# Altium schematic sheet Rcrd Brkr.SchDoc
size A3
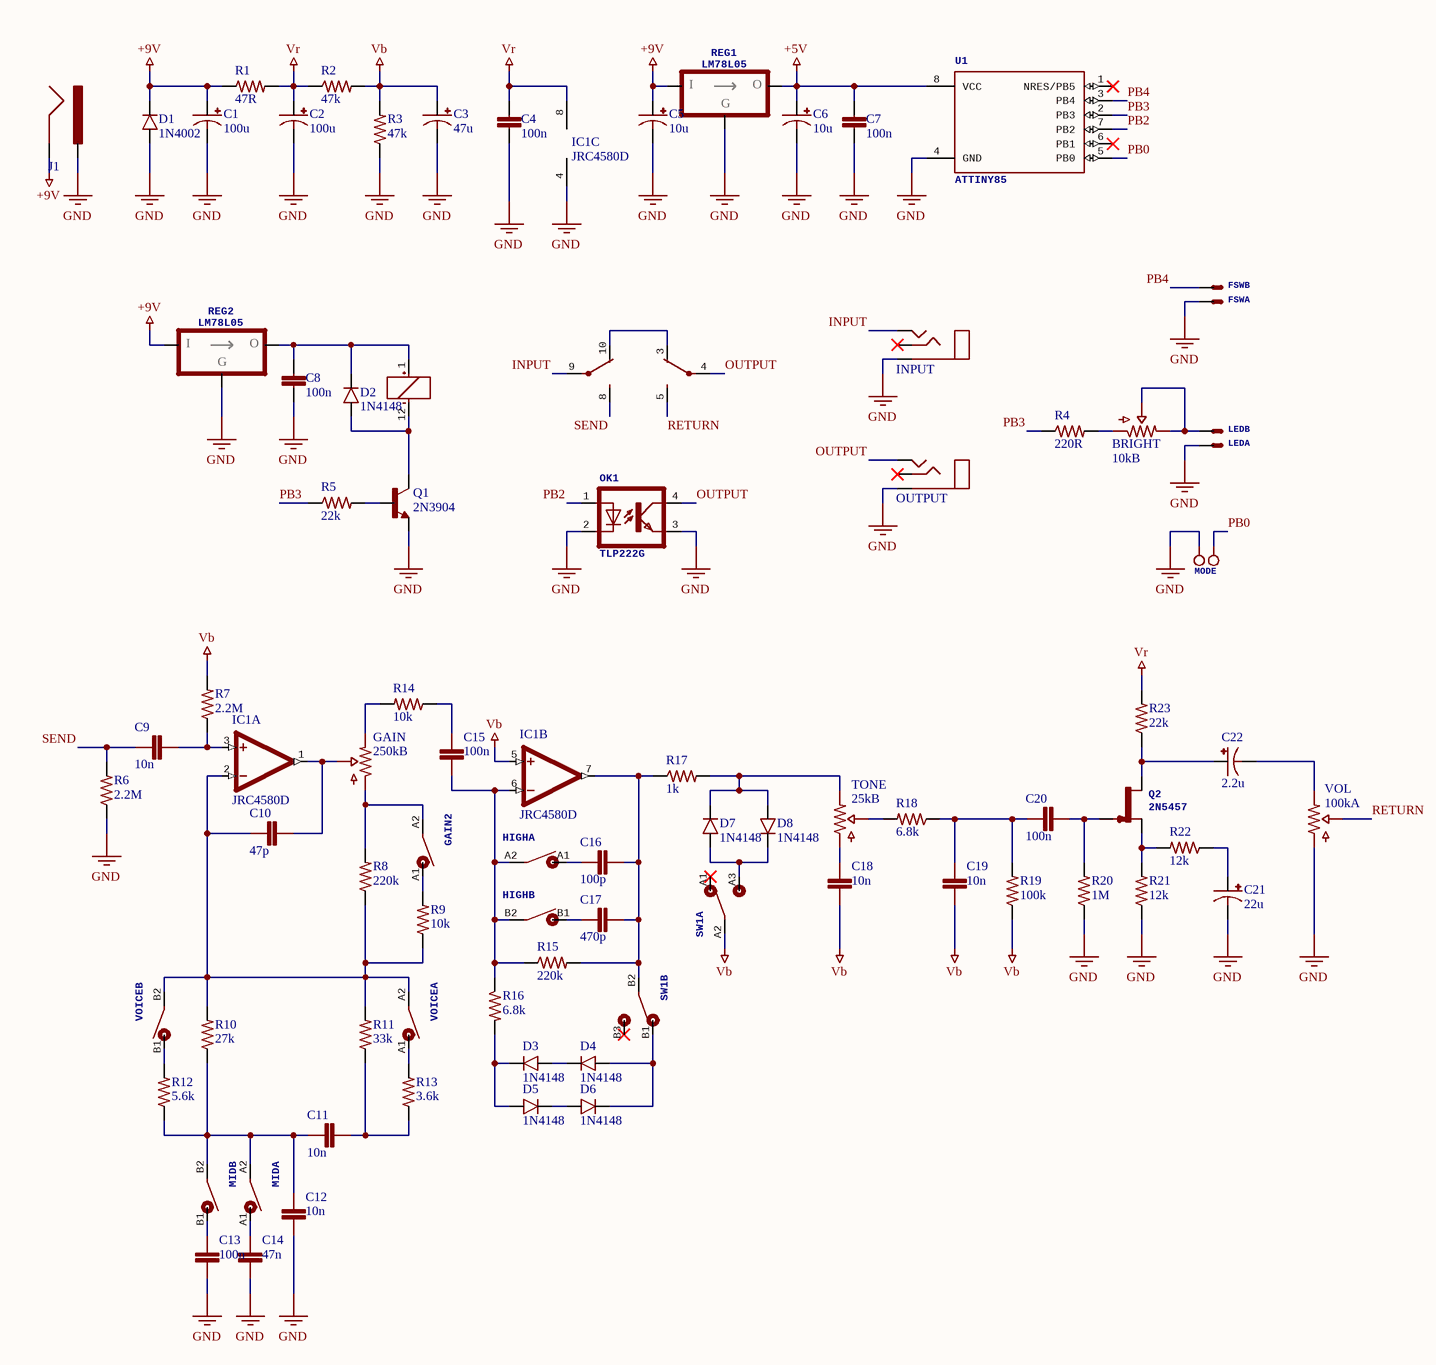
[diagram p0: Rcrd Brkr.SchDoc]

## Parts
BRIGHT  10kB  [BOURNS_3362P]
C1  100u  [ELEC_050_020]
C2  100u  [ELEC_050_020]
C3  47u  [ELEC_050_020]
C4  100n  [CER_050]
C5  10u  [ELEC_040_020]
C6  10u  [ELEC_040_020]
C7  100n  [CER_050]
C8  100n  [CER_050]
C9  10n  [FILMBOX_SMALL]
C10  47p  [CER_050]
C11  10n  [FILMBOX_SMALL]
C12  10n  [FILMBOX_SMALL]
C13  100n  [FILMBOX_SMALL]
C14  47n  [FILMBOX_SMALL]
C15  100n  [FILMBOX_SMALL]
C16  100p  [CER_050]
C17  470p  [CER_050]
C18  10n  [FILMBOX_SMALL]
C19  10n  [FILMBOX_SMALL]
C20  100n  [FILMBOX_SMALL]
C21  22u  [ELEC_LESR_050_020]
C22  2.2u  [ELEC_LESR_050_020]
D1  1N4002  [DO41_2]
D2  1N4148  [DO35_2]
D3  1N4148  [DO35_2]
D4  1N4148  [DO35_2]
D5  1N4148  [DO35_2]
D6  1N4148  [DO35_2]
D7  1N4148  [DO35_2]
D8  1N4148  [DO35_2]
FSW  (no value)  [JST-XH-02]  (parts A,B of 2)
GAIN  250kB  [ALPHA_16mm_BOTTOM]
GAIN2  DIP  [DIP_1WAY]  (value not drawn)
HIGH  DIP  [DIP_2WAY]  (value not drawn)  (parts A,B of 2)
IC1  JRC4580D  [DIL8]  (parts A,B,C of 3)
INPUT  (no value)  [STEREO]
J1  DC_JACK  [DC_JACK]  (value not drawn)
K1  (no value)  [NA5]  (parts A,B,C of 3)
LED  (no value)  [JST-XH-02]  (parts A,B of 2)
MID  DIP  [DIP_2WAY]  (value not drawn)  (parts A,B of 2)
MODE  HEADER_2PINS  [HEADER_2PINS]  (value not drawn)
OK1  TLP222G  [DIL4]
OUTPUT  (no value)  [STEREO]
Q1  2N3904  [TO92]
Q2  2N5457  [TO92]
R1  47R  [R_3_47R_025W]
R2  47k  [R_3_47k_025W]
R3  47k  [R_3_47k_025W]
R4  220R  [R_3_220R_025W]
R5  22k  [R_3_22k_025W]
R6  2.2M  [R_3_2,2M_025W]
R7  2.2M  [R_3_2,2M_025W]
R8  220k  [R_3_220k_025W]
R9  10k  [R_3_10k_025W]
R10  27k  [R_3_27k_025W]
R11  33k  [R_3_33k_025W]
R12  5.6k  [R_3_5.6k_025W]
R13  3.6k  [R_3_3.6k_025W]
R14  10k  [R_3_10k_025W]
R15  220k  [R_3_220k_025W]
R16  6.8k  [R_3_6.8k_025W]
R17  1k  [R_3_1k_025W]
R18  6.8k  [R_3_6.8k_025W]
R19  100k  [R_3_100k_025W]
R20  1M  [R_3_1M_025W]
R21  12k  [R_3_12k_025W]
R22  12k  [R_3_12k_025W]
R23  22k  [R_3_22k_025W]
REG1  LM78L05  [TO92]
REG2  LM78L05  [TO92]
SW1  DPDT  [DPDT]  (value not drawn)  (parts A,B of 2)
TONE  25kB  [ALPHA_16mm_BOTTOM]
U1  ATTINY85  [DIP8]
VOICE  DIP  [DIP_2WAY]  (value not drawn)  (parts A,B of 2)
VOL  100kA  [ALPHA_16mm_BOTTOM]

## Nets
+5V: C6.+ C7.2 REG1.3(VO) U1.8(VCC)
+9V: C1.+ C5.+ D1.C J1.GND R1.1 REG1.1(VI) REG2.1(VI)
GND: C1.- C2.- C3.- C4.2 C5.- C6.- C7.1 C8.2 C12.2 C13.2 C14.2 C21.- D1.A FSW.2(S) IC1.4(V-) INPUT.S J1.PWR LED.2(S) MODE.1 OK1.2(C) OK1.3(EMIT) OUTPUT.S Q1.3(E) R3.1 R6.1 R20.1 R21.1 REG1.2(GND) REG2.2(GND) U1.4(GND) VOL.1
Vb: C3.+ C18.2 C19.1 IC1.5(+IN) R2.2 R3.2 R7.2 R19.1 SW1.A2
Vr: C2.+ C4.1 IC1.8(V+) R1.2 R2.1 R23.2
INPUT: INPUT.T K1.9(P)
OUTPUT: K1.4(P) OK1.4(COL) OUTPUT.T
PB0: MODE.2 U1.5(PB0)
PB2: OK1.1(A) U1.7(PB2)
PB3: R4.1 R5.1 U1.2(PB3)
PB4: FSW.1(S) U1.3(PB4)
RETURN: K1.5(S) VOL.2
SEND: C9.2 K1.8(S) R6.2
NetBRIGHT_1: BRIGHT.1 R4.2
NetBRIGHT_2: BRIGHT.2 BRIGHT.3 LED.1(S)
NetC8_1: C8.1 D2.C K1.1(+) REG2.3(VO)
NetC9_1: C9.1 IC1.3(+IN) R7.1
NetC10_1: C10.1 GAIN.2 IC1.1(OUT)
NetC10_2: C10.2 IC1.2(-IN) R8.1 R9.1 R10.2 R11.2 VOICE.A2 VOICE.B2
NetC11_1: C11.1 R11.1 R13.1
NetC11_2: C11.2 C12.1 MID.A2 MID.B2 R10.1 R12.1
NetC13_1: C13.1 MID.B1
NetC14_1: C14.1 MID.A1
NetC15_1: C15.1 R14.1
NetC15_2: C15.2 HIGH.A2 HIGH.B2 IC1.6(-IN) R15.1 R16.1
NetC16_1: C16.1 C17.1 IC1.7(OUT) R15.2 R17.1 SW1.B2
NetC16_2: C16.2 HIGH.A1
NetC17_2: C17.2 HIGH.B1
NetC18_1: C18.1 TONE.1
NetC19_2: C19.2 C20.2 R18.1 R19.2
NetC20_1: C20.1 Q2.1(G) R20.2
NetC21_+: C21.+ R22.1
NetC22_+: C22.+ Q2.3(D) R23.1
NetC22_-: C22.- VOL.3
NetD2_A: D2.A K1.12(-) Q1.1(C)
NetD3_A: D3.A D4.C
NetD3_C: D3.C D5.A R16.2
NetD4_A: D4.A D6.C SW1.B1
NetD5_C: D5.C D6.A
NetD7_A: D7.A D8.C SW1.A3
NetD7_C: D7.C D8.A R17.2 TONE.3
NetGAIN2_A1: GAIN2.A1 R9.2
NetGAIN_1: GAIN.1 GAIN2.A2 R8.2
NetGAIN_3: GAIN.3 R14.2
NetK1_3: K1.3(O) K1.10(O)
NetQ1_2: Q1.2(B) R5.2
NetQ2_2: Q2.2(S) R21.2 R22.2
NetR12_2: R12.2 VOICE.B1
NetR13_2: R13.2 VOICE.A1
NetR18_2: R18.2 TONE.2

Not connected (* = marked no-connect by the designer): INPUT R*; OUTPUT R*; SW1 A1(1)* B3(3)*; U1 1(NRES/PB5)* 6(PB1)*

## Notes on the sheet
- (in symbol LM78L05) I; O; G

## Library data of the parts
BRIGHT = TRIM_10kB_3362P: 10k Lin 3362P trimmer; Price: 0.1
C1 C2 = C_ELEC_100u_16V: 100u 16V electrolytic capacitor; PinSpacing: 2mm; Price: 0.02; Dimensions: 5x8mm; Package: Radial
C3 = ELEC_47u_25V: 47u 25V electrolytic capacitor; PinSpacing: 2mm; Dimensions: 5x8mm; Package: Radial; Price: 0.02
C4 C7 C8 = CER_100n: 100n MLCC X7R radial capacitor; PinSpacing: 5.08mm; Package: Radial; Price: 0.02
C5 C6 = ELEC_10u_50V: 10u 50V electrolytic capacitor; PinSpacing: 2mm; Dimensions: 4x8mm; Package: Radial; Price: 0.02
C9 C11 C12 C18 C19 = FILMBOX_10n: 10n 100V polyester film box capacitor; PinSpacing: 5.08mm; Dimensions: 7.2x2.5x6.5mm; Package: Radial; Price: 0.05
C10 = C_CER_47p: 47p MLCC X7R radial capacitor; PinSpacing: 5.08mm; Price: 0.01; Package: Radial
C13 C20 = C_FILMBOX_100n: 100n 100V polyester film box capacitor; PinSpacing: 5.08mm; Price: 0.05; Dimensions: 7.2x2.5x6.5mm; Package: Radial
C14 = C_FILMBOX_47n: 47n 100V polyester film box capacitor; PinSpacing: 5.08mm; Price: 0.05; Dimensions: 7.2x2.5x6.5mm; Package: Radial
C15 = FILMBOX_100n: 100n 100V polyester film box capacitor; PinSpacing: 5.08mm; Dimensions: 7.2x2.5x6.5mm; Package: Radial; Price: 0.05
C16 = C_CER_100p: 100p MLCC X7R radial capacitor; PinSpacing: 5.08mm; Price: 0.01; Package: Radial
C17 = C_CER_470p: 470p MLCC X7R radial capacitor; PinSpacing: 5.08mm; Price: 0.01; Package: Radial
C21 = C_ELEC_LESR_22u_50V: 22u 50V Low ESR ectrolytic capacitor; PinSpacing: 2mm; Price: 0.05; Dimensions: 5x11mm; Package: Radial
C22 = C_ELEC_LESR_2.2u_50V: 2.2u 50V Low ESR ectrolytic capacitor; PinSpacing: 2mm; Price: 0.05; Dimensions: 5x11mm; Package: Radial
D1 = 1N4002: PinSpacing: 7.62mm; Package: DO-41; Price: 0.01
D2-D8 = 1N4148: PinSpacing: 5.08mm; Price: 0.01; Package: DO-35
FSW LED = JST-XH-02: 2 Pins male XH header; Price: 0.1
GAIN = 250kB_ALPHA_16mm: 250k Lin potentiometer round shaft; Price: 0.5; Dimensions: 16mm; Package: PCB Mounted
GAIN2 = SW_DIP_1WAY: DIP Switch 1 way; Price: 0.5
HIGH MID VOICE = SW_DIP_2WAY: DIP Switch 2 way; Price: 0.5
INPUT OUTPUT = STEREO: 6.35mm stereo insulated socket jack PCB mounted; Price: 0.5
J1 = DC_JACK: DC Power jack 2.1mm barrel; Price: 0.05
K1 = NA5W-K: Price: 1.1
MODE = HEADER_2PINS: 2 Pins male header; Pin spacing: 2.54mm; Price: 0.01
Q2 = Q_2N5457: Price: 0.2; Package: TO-92
R1 = R_3_47R_025W: 47R metal film 1/4W Resistor; PinSpacing: 7.62mm; Price: 0.01
R2 R3 = R_3_47k_025W: 47k metal film 1/4W Resistor; PinSpacing: 7.62mm; Price: 0.01
R4 = R_3_220R_025W: 220R metal film 1/4W Resistor; PinSpacing: 7.62mm; Price: 0.01
R5 R23 = R_3_22k_025W: 22k metal film 1/4W Resistor; PinSpacing: 7.62mm; Price: 0.01
R6 R7 = R_3_2.2M_025W: 2.2M metal film 1/4W Resistor; PinSpacing: 7.62mm; Price: 0.01
R8 R15 = R_3_220k_025W: 220k metal film 1/4W Resistor; PinSpacing: 7.62mm; Price: 0.01
R9 R14 = R_3_10k_025W: 10k metal film 1/4W Resistor; PinSpacing: 7.62mm; Price: 0.01
R10 = R_3_27k_025W: 27k metal film 1/4W Resistor; PinSpacing: 7.62mm; Price: 0.01
R11 = R_3_33k_025W: 33k metal film 1/4W Resistor; PinSpacing: 7.62mm; Price: 0.01
R12 = R_3_5.6k_025W: 5.6k metal film 1/4W Resistor; PinSpacing: 7.62mm; Price: 0.01
R13 = R_3_3.6k_025W: 3.6k metal film 1/4W Resistor; PinSpacing: 7.62mm; Price: 0.01
R16 R18 = R_3_6.8k_025W: 6.8k metal film 1/4W Resistor; PinSpacing: 7.62mm; Price: 0.01
R17 = R_3_1k_025W: 1k metal film 1/4W Resistor; PinSpacing: 7.62mm; Price: 0.01
R19 = R_3_100k_025W: 100k metal film 1/4W Resistor; PinSpacing: 7.62mm; Price: 0.01
R20 = R_3_1M_025W: 1M metal film 1/4W Resistor; PinSpacing: 7.62mm; Price: 0.01
R21 R22 = R_3_12k_025W: 12k metal film 1/4W Resistor; PinSpacing: 7.62mm; Price: 0.01
REG1 REG2 = LM78L05: 78L05; Package: TO-92; Price: 0.01
SW1 = DPDT_ON-OFF-ON: DPDT toggle switch ON/OFF/ON; Price: 0.5
TONE = 25kB_ALPHA_16mm: 25k Lin potentiometer round shaft; Price: 0.5; Dimensions: 16mm; Package: PCB Mounted
U1 = ATTINY85: ATTINY85-20PU; Package: DIP-8; Price: 1.2
VOL = 100kA_ALPHA_16mm: 100k Log potentiometer round shaft; Price: 0.5; Dimensions: 16mm; Package: PCB Mounted
IC1 = JRC4580D: Package: DIP-8; Price: 0.5
OK1 = TLP222G: Price: 0.36
Q1 = 2N3904: Package: TO-92; Price: 0.01